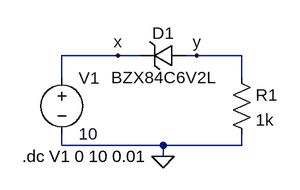
[diagram p0: schematic zener rev_S20210020323.asc]
zener rev_S20210020323.asc, the LTspice schematic file:
Version 4
SHEET 1 880 680
WIRE 48 96 -32 96
WIRE 80 96 48 96
WIRE 160 96 144 96
WIRE 224 96 160 96
WIRE -32 128 -32 96
WIRE 224 128 224 96
WIRE -32 224 -32 208
WIRE 112 224 -32 224
WIRE 224 224 224 208
WIRE 224 224 112 224
WIRE 112 240 112 224
FLAG 112 240 0
FLAG 48 96 x
FLAG 160 96 y
SYMBOL voltage -32 112 R0
WINDOW 123 0 0 Left 0
WINDOW 39 0 0 Left 0
SYMATTR InstName V1
SYMATTR Value 10
SYMBOL res 208 112 R0
SYMATTR InstName R1
SYMATTR Value 1k
SYMBOL zener 144 80 R90
WINDOW 0 0 32 VBottom 2
WINDOW 3 32 32 VTop 2
SYMATTR InstName D1
SYMATTR Value BZX84C6V2L
SYMATTR Description Diode
SYMATTR Type diode
TEXT -88 240 Left 2 !.dc V1 0 10 0.01

The netlist it stands for:
* zener rev_S20210020323.asc
V1 x 0 10
R1 y 0 1k
D1 y x BZX84C6V2L
.model D D
.lib standard.dio
.dc V1 0 10 0.01
.backanno
.end